# EasyEDA Pro project ProPrj_RC-Plate_2025-08-21.epro

# Schematic Schematic1
Board Name: Board1; Create Date: 2025-05-20; Page Name: P1; Project Name: RC-Plate; Schematic Name: Schematic1; Update Date: 2025-05-20; Company: EasyEDA.com; Page Size: A4; Version: V1.0
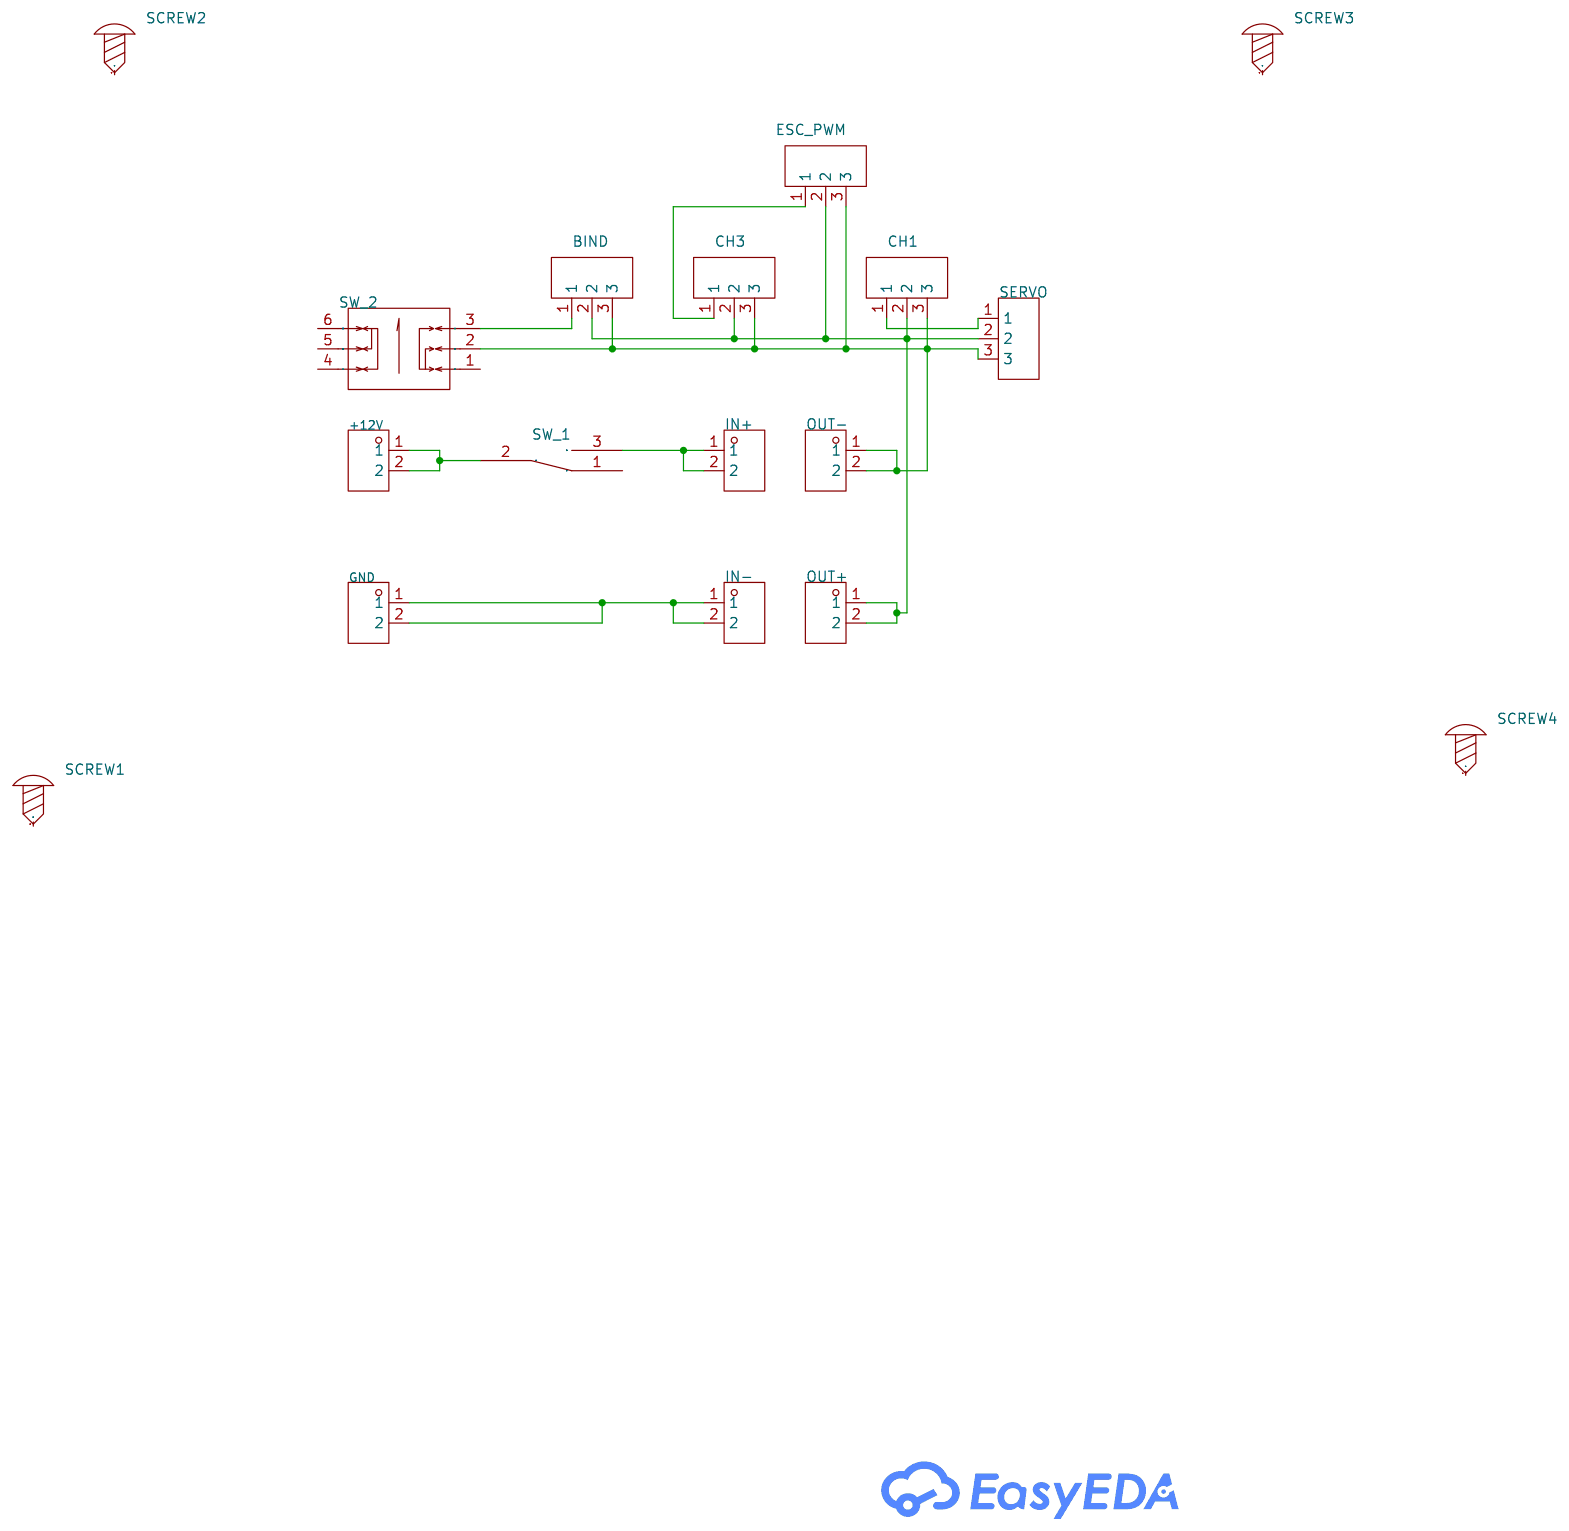
[diagram p0: schematic sheet]

## Parts
+12V  KF301-5.0-2P  [CONN-TH_P5.00_KF301-5.0-2P]
BIND  PM254V-11-03-H85  [HDR-TH_3P-P2.54-V-F]
CH1  PM254V-11-03-H85  [HDR-TH_3P-P2.54-V-F]
CH3  PM254V-11-03-H85  [HDR-TH_3P-P2.54-V-F]
ESC_PWM  PZ254V-11-03P  [HDR-TH_3P-P2.54-V-M]
GND  KF301-5.0-2P  [CONN-TH_P5.00_KF301-5.0-2P]
IN+  ZX-PM2.54-1-2PY  [HDR-TH_2P-P2.54-V-F]
IN-  ZX-PM2.54-1-2PY  [HDR-TH_2P-P2.54-V-F]
OUT+  ZX-PM2.54-1-2PY  [HDR-TH_2P-P2.54-V-F]
OUT-  ZX-PM2.54-1-2PY  [HDR-TH_2P-P2.54-V-F]
SCREW1  -  [Screw-Hole-M2]
SCREW2  -  [Screw-Hole-M2]
SCREW3  -  [Screw-Hole-M2]
SCREW4  -  [Screw-Hole-M2]
SERVO  PZ254V-11-03P  [HDR-TH_3P-P2.54-V-M]
SW_1  ST-0-102-A01-T000-LF  [SW-TH_3P-L8.3-W5.2-P2.54_ST-0-102-A01-T000]
SW_2  8-8 ZS  [SW-TH_6P-L8.0-W8.0-P2.50-TL]

## Library data of the parts
+12V GND = KF301-5.0-2P: Structure:1x2P Pitch:5mm Color:Blue Mounting Style:Straight Current Rating (Max):17A Voltage Rating (Max):250V Number of Pins:2P Number of Rows:1 Wire Gauge - AWG:14~22 Wire Gauge - AWG:14~22 Wire Gauge - mm2:1.5 Wire Gauge - mm2:1.5 Number of PINs Per Ro; LCSC Part Name: 5mm 1x2P 排数:1 每排P数:2 直插; Supplier Part: C474881; Manufacturer: KEFA(科发); Supplier Footprint: 插件,P=5mm; JLCPCB Part Class: Extended Part; Datasheet: https://atta.szlcsc.com/upload/public/pdf/source/20230317/03A5B5FC229D6F9225E8F51DA1A4E80A.pdf; Supplier: LCSC; Structure: 1x2P; Pitch: 5mm; Color: Blue; Mounting Style: Straight; Current Rating (Max): 17A; Voltage Rating (Max): 250V; Number of Pins: 2P; Number of Rows: 1; Wire Gauge - AWG: 14~22; Wire Gauge - mm2: 1.5; Number of PINs Per Row: 2; Operating Temperature Range: -30℃~+120℃
BIND CH1 CH3 = PM254V-11-03-H85: Holes Structure:1x3P Pitch:2.54mm Row Spacing:- Mounting Type:Straight Number of Rows:Plugin Number of Holes:3P Insulation Height:- Contact Material:Brass Contact Plating:-; LCSC Part Name: 间距:2.54mm 1x3P 直插; Supplier Part: C541850; Manufacturer: XFCN(兴飞); Supplier Footprint: 插件,P=2.54mm; JLCPCB Part Class: Extended Part; Datasheet: https://atta.szlcsc.com/upload/public/pdf/source/20200518/C541849_85853D71FC67C51915A806977A588FDA.pdf; Supplier: LCSC; Holes Structure: 1x3P; Pitch: 2.54mm; Mounting Type: Straight; Number of Rows: Plugin; Number of Holes: 3P; Contact Material: Brass
ESC_PWM SERVO = PZ254V-11-03P: Pin Structure:1x3P Pitch:2.54mm Row Spacing:- Circluar Pins/Square Pins:Policy Mounting Type:Straight Number of Rows:Single Row Number of Pins:3P Current Rating:3A Voltage Rating (Max):250V Length of Mating Pin:6mm Insulation Height:2.5mm Length of End Co; LCSC Part Name: 1x3P 间距:2.54mm 方针 直插; Supplier Part: C2937625; Manufacturer: XFCN(兴飞); Supplier Footprint: 插件,P=2.54mm; JLCPCB Part Class: Extended Part; Datasheet: https://atta.szlcsc.com/upload/public/pdf/source/20200309/C492402_8335C3D49C4E4C618838D59BB1D024C1.pdf; Supplier: LCSC; Pin Structure: 1x3P; Pitch: 2.54mm; Circluar Pins/Square Pins: Policy; Mounting Type: Straight; Number of Rows: Single Row; Number of Pins: 3P; Current Rating: 3A; Voltage Rating (Max): 250V; Length of Mating Pin: 6mm; Insulation Height: 2.5mm; Length of End Connection Pin: 3mm; Operating Temperature: -40℃~+105℃; Color: Black
IN+ IN- OUT+ OUT- = ZX-PM2.54-1-2PY: Holes Structure:1x2P Pitch:2.54mm Row Spacing:- Circular Hole / Square Hole:Square Hole Mounting Type:Direct Insert Number of Rows:Single Row Number of Holes:2P Current Rating (Max):- Voltage Rating (Max):1kV Holes Direction:Top Insulation Height:8.5mm Co; LCSC Part Name: 1x2P 间距:2.54mm 直插; Supplier Part: C7499322; Manufacturer: Megastar(兆星); Supplier Footprint: 插件,P=2.54mm; JLCPCB Part Class: Extended Part; Datasheet: https://atta.szlcsc.com/upload/public/pdf/source/20231122/F22175ABE3DCBFEB9E36A2E7DA44623C.pdf; Supplier: LCSC; Holes Structure: 1x2P; Pitch: 2.54mm; Circular Hole / Square Hole: Square Hole; Mounting Type: Direct Insert; Number of Rows: Single Row; Number of Holes: 2P; Voltage Rating (Max): 1kV; Holes Direction: Top; Insulation Height: 8.5mm; Contact Plating: Gold; Operating Temperature Range: -40℃~+105℃; Soldering Temperature(Max): 260℃@5S
SCREW1-SCREW4 = Screw-Hole-M2: Supplier Footprint: 插件
SW_1 = ST-0-102-A01-T000-LF: Circuit:Single Pole Double Throw (SPDT) Switch Length:8.3mm Switch Width:5.2mm Switch Height:23.6mm Mechanical Life:- Contact Current:3A Voltage Rating (AC):125V Actuator Type:Cylinder knob Pin Style:Solder Mounting Style:Direct Insert Operating Temperatu; LCSC Part Name: 超小型钮子三脚二档 五件套 含配件; Supplier Part: C1788487; Manufacturer: YUEN FUNG(源丰); Supplier Footprint: 插件; JLCPCB Part Class: Extended Part; Datasheet: https://atta.szlcsc.com/upload/public/pdf/source/20230720/31DDFEC61AC21D005BE18E754C3E93F0.pdf; Supplier: LCSC; Circuit: Single Pole Double Throw (SPDT); Switch Length: 8.3mm; Switch Width: 5.2mm; Switch Height: 23.6mm; Contact Current: 3A; Voltage Rating (AC): 125V; Actuator Type: Cylinder knob; Pin Style: Solder; Mounting Style: Direct Insert; Operating Temperature: -25℃~+85℃
SW_2 = 8-8 ZS: Circuit:DPDT Self Lock / No Lock:LATCHING Actuator Style:Rectangular Plunger IP Rating:- Mounting Style:Straight Contact Current:100mA Voltage Rating (AC):- Voltage Rating (DC):30V Insulation Resistance:100MΩ Actuator/Cap Color:Blue With Lamp:不带 Pin Style; LCSC Part Name: 按键开关8x8 自锁高头 180gf; Supplier Part: C5379893; Manufacturer: SHOU HAN(首韩); Supplier Footprint: 插件; JLCPCB Part Class: Extended Part; Datasheet: https://atta.szlcsc.com/upload/public/pdf/source/20230920/344D9C55231D4D6DD37BED301252459B.pdf; Supplier: LCSC; Circuit: DPDT; Self Lock / No Lock: LATCHING; Actuator Style: Rectangular Plunger; Mounting Style: Straight; Contact Current: 100mA; Voltage Rating (DC): 30V; Insulation Resistance: 100MΩ; Actuator/Cap Color: Blue; With Lamp: 不带; Pin Style: PCPin; Operating Force: 180gf; Operating Temperature: -10℃~+70℃; Mechanical Life: 5千次

## Nets
$1N1038: BIND.2 CH1.2 CH3.2 ESC_PWM.2 OUT+.1 OUT+.2 SERVO.2
$1N1638: CH1.1 SERVO.1
$1N1730: CH3.1 ESC_PWM.1
$1N1971: +12V.1 +12V.2 SW_1.2
$1N1976: GND.1 GND.2 IN-.1 IN-.2
$1N2611: IN+.1 IN+.2 SW_1.3
Net-(BIND-1): BIND.1 SW_2.3
Net-(BIND-3): BIND.3 CH1.3 CH3.3 ESC_PWM.3 OUT-.1 OUT-.2 SERVO.3 SW_2.2

Not connected (* = marked no-connect by the designer): SCREW1 1; SCREW2 1; SCREW3 1; SCREW4 1; SW_1 1; SW_2 1 4 5 6

# Board RC-Plate1
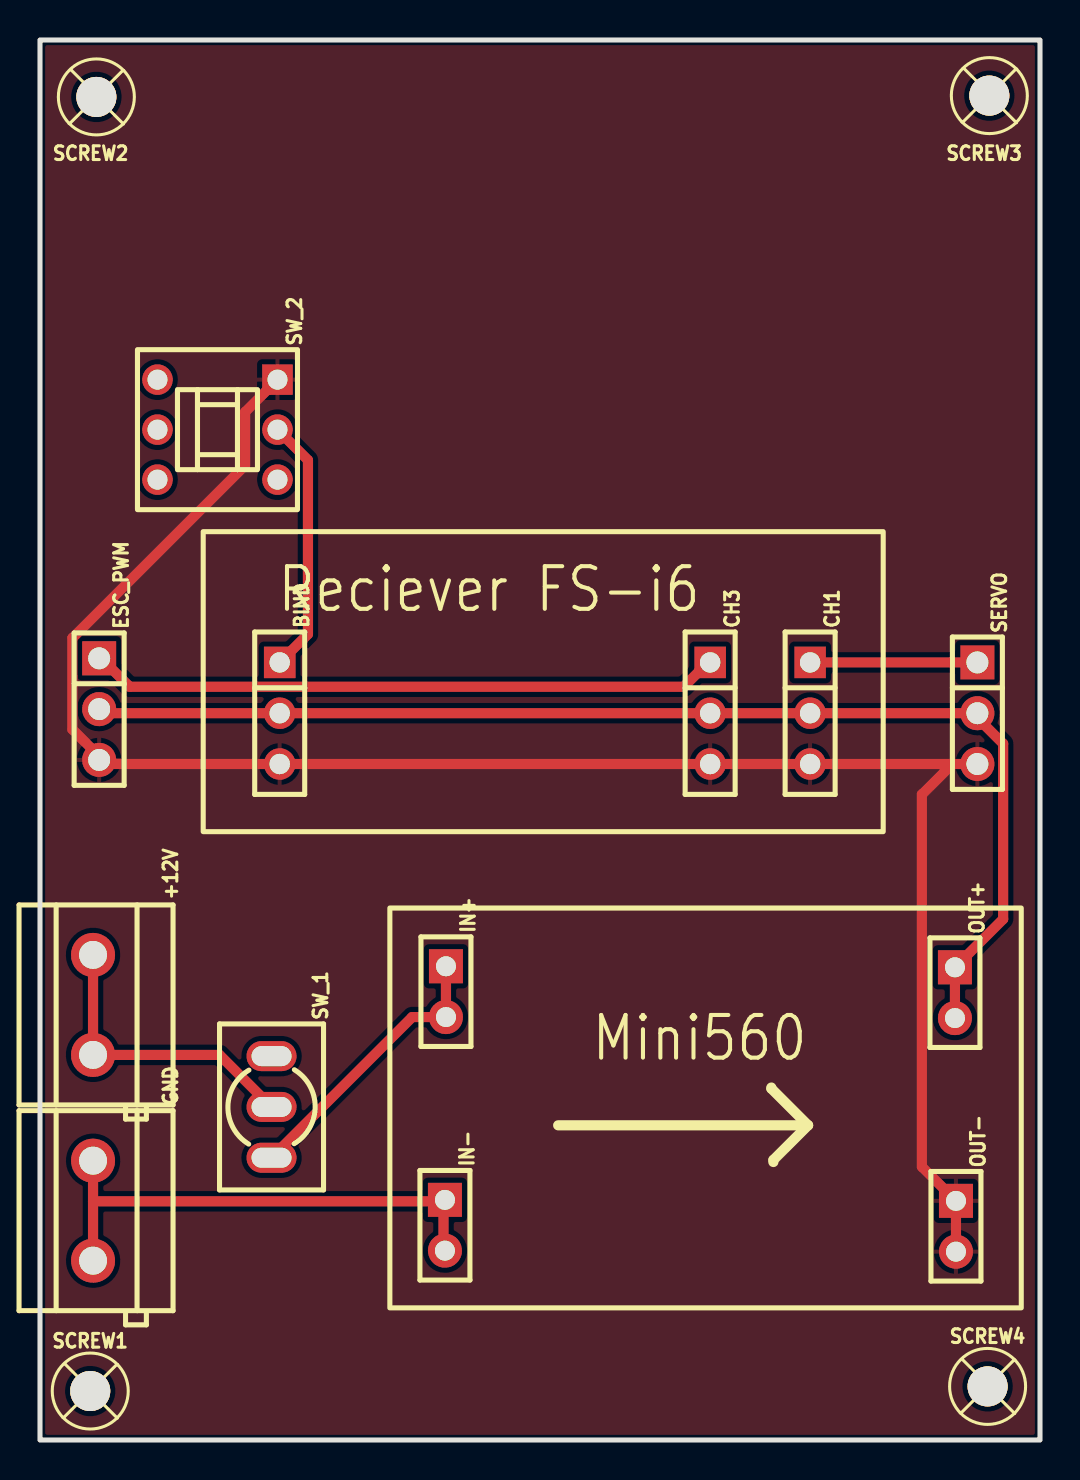
[diagram p1: board, top side]
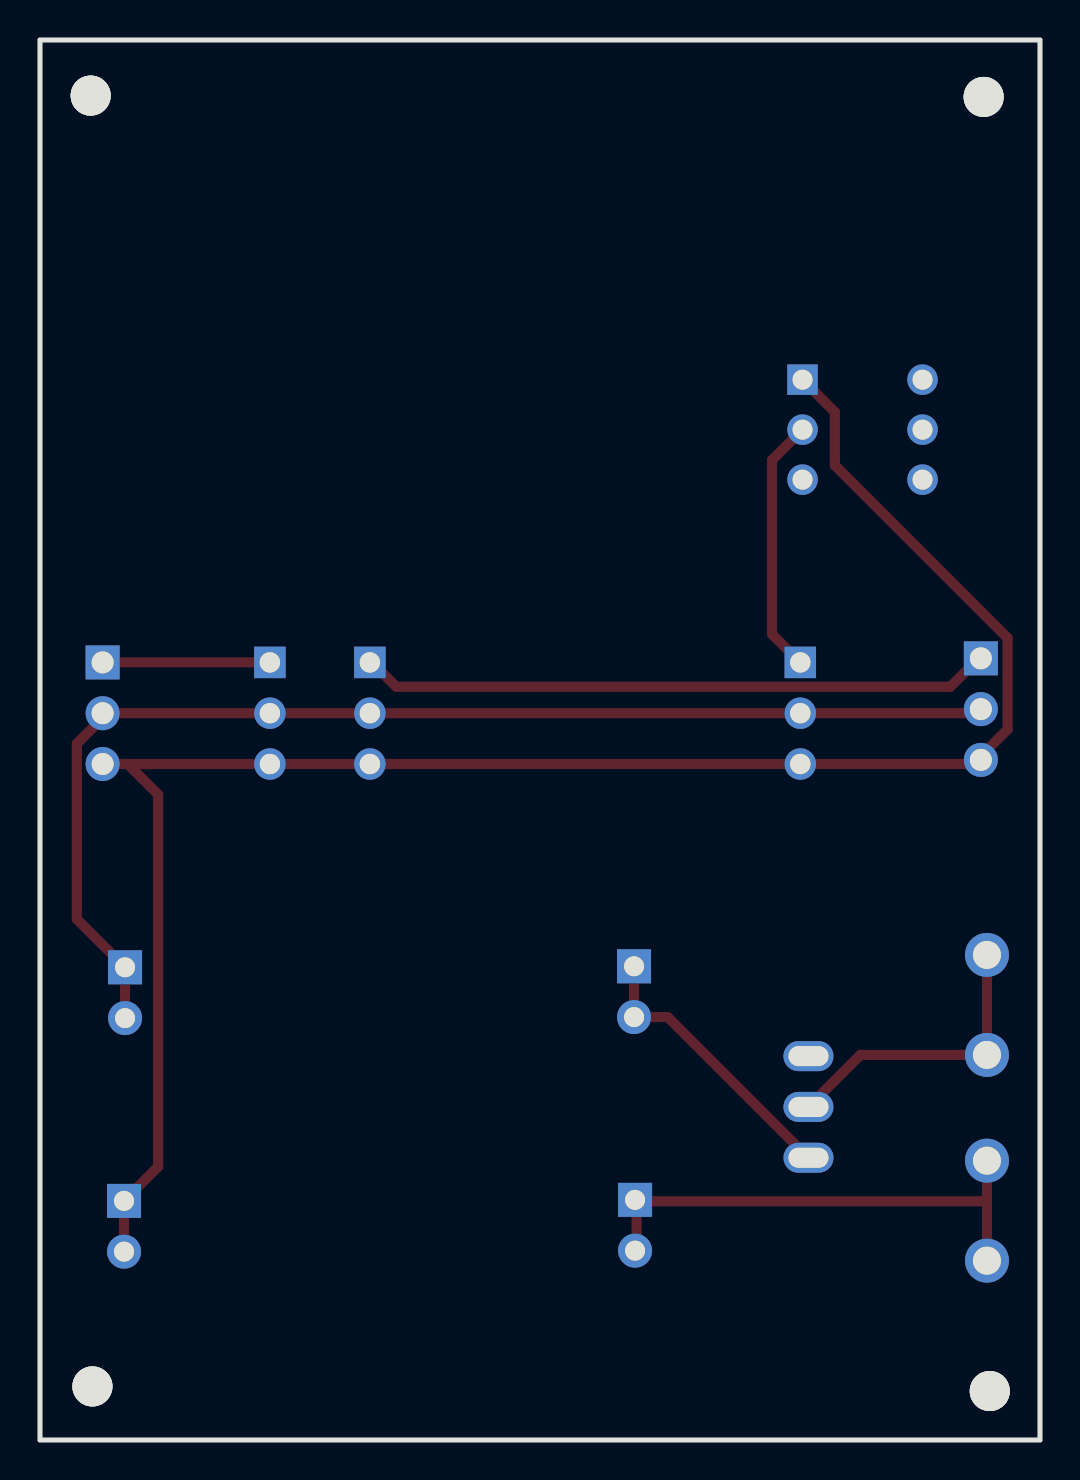
[diagram p2: board, bottom side, seen from below]

Outline 50 x 70 mm; copper layers: Top Layer, Bottom Layer. Coordinates in mm from the lower left corner of the outline.
Outline path: rectangle 0,70 50,0
Stack: Top Layer 0.035mm / Dielectric1 1.51mm FR4 er 4.5 / Bottom Layer 0.035mm

## Design rules (mm)
template: Custom Config
spacing copperThickness1oz (default): track to track 0.102, other pairs 0.152 to 0.3
spacing copperThickness2oz: track to track 0.203, other pairs 0.152 to 0.3
track width copperThickness1oz: min 0.127, default 0.254, max 2.54
track width copperThickness2oz: min 0.203, default 0.254, max 2.54
track width thrack3oz (default): min 0.254, default 0.508, max 2.54
differential pair differentialPair (default): width min 0.127, default 0.254, max 2.54; gap min 0.152, default 0.152
via viaSize (default): diameter min 0.5, default 0.61, max 10; hole min 0.3, default 0.305, max 6.3

## Placement (name value [footprint] x y rotation side)
+12V  KF301-5.0-2P  [CONN-TH_P5.00_KF301-5.0-2P]  2.65 21.75 270 top
BIND  PM254V-11-03-H85  [HDR-TH_3P-P2.54-V-F]  11.98 36.34 270 top
CH1  PM254V-11-03-H85  [HDR-TH_3P-P2.54-V-F]  38.51 36.34 270 top
CH3  PM254V-11-03-H85  [HDR-TH_3P-P2.54-V-F]  33.51 36.34 270 top
ESC_PWM  PZ254V-11-03P  [HDR-TH_3P-P2.54-V-M]  2.96 36.54 270 top
GND  KF301-5.0-2P  [CONN-TH_P5.00_KF301-5.0-2P]  2.65 11.47 270 top
IN+  ZX-PM2.54-1-2PY  [HDR-TH_2P-P2.54-V-F]  20.3 22.42 270 top
IN-  ZX-PM2.54-1-2PY  [HDR-TH_2P-P2.54-V-F]  20.25 10.74 270 top
OUT+  ZX-PM2.54-1-2PY  [HDR-TH_2P-P2.54-V-F]  45.75 22.37 270 top
OUT-  ZX-PM2.54-1-2PY  [HDR-TH_2P-P2.54-V-F]  45.8 10.69 270 top
SCREW1  -  [Screw-Hole-M2]  2.51 2.45 0 top
SCREW2  -  [Screw-Hole-M2]  2.82 67.15 0 top
SCREW3  -  [Screw-Hole-M2]  47.47 67.22 0 top
SCREW4  -  [Screw-Hole-M2]  47.38 2.68 0 top
SERVO  PZ254V-11-03P  [HDR-TH_3P-P2.54-V-M]  46.87 36.34 270 top
SW_1  ST-0-102-A01-T000-LF  [SW-TH_3P-L8.3-W5.2-P2.54_ST-0-102-A01-T000]  11.58 16.65 270 top
SW_2  8-8 ZS  [SW-TH_6P-L8.0-W8.0-P2.50-TL]  8.87 50.52 270 top

## Footprints (pads in the part's own frame, mm; a bottom-side part is the same pattern mirrored in y, then rotated)
CONN-TH_P5.00_KF301-5.0-2P
  round 2.2 hole 1.4: 1(-2.5,0) 2(2.5,0)
HDR-TH_2P-P2.54-V-F
  rect 1.7x1.7 hole 1: 1(-1.27,0)
  round 1.7 hole 1: 2(1.27,0)
HDR-TH_3P-P2.54-V-F
  rect 1.575x1.575 hole 1.02: 1(-2.54,0)
  round 1.575 hole 1.02: 2(0,0) 3(2.54,0)
HDR-TH_3P-P2.54-V-M
  rect 1.7x1.7 hole 1.1: 1(-2.54,0)
  round 1.7 hole 1.1: 2(0,0) 3(2.54,0)
Screw-Hole-M2
  round 2 hole 2: 1(0,0)
SW-TH_3P-L8.3-W5.2-P2.54_ST-0-102-A01-T000
  oval 1.5x2.5 hole 1x2: 1(-2.54,0) 2(0,0) 3(2.54,0)
SW-TH_6P-L8.0-W8.0-P2.50-TL
  rect 1.524x1.524 hole 1: 1(-2.5,3)
  round 1.524 hole 1: 2(0,3) 3(2.5,3) 4(-2.5,-3) 5(0,-3) 6(2.5,-3)

## Nets
$1N1038: BIND.2 CH1.2 CH3.2 ESC_PWM.2 OUT+.1 OUT+.2 SERVO.2
$1N1056: BIND.3 CH1.3 CH3.3 ESC_PWM.3 OUT-.1 OUT-.2 SERVO.3 SW_2.1
$1N1638: CH1.1 SERVO.1
$1N1730: CH3.1 ESC_PWM.1
$1N1874: BIND.1 SW_2.2
$1N1971: +12V.1 +12V.2 SW_1.2
$1N1976: GND.1 GND.2 IN-.1 IN-.2
$1N2611: IN+.1 IN+.2 SW_1.3

Pads without a net: SCREW1 1; SCREW2 1; SCREW3 1; SCREW4 1; SW_1 1; SW_2 3 4 5 6

## Routing (per net, layer and track width the routed paths; a pad name or vN(x,y) marks a point on that pad's centre or on a via; arc(x,y) is an arc through that point)
$1N1038: length 60.9
  Top Layer w0.508: ESC_PWM.2 3.16,36.34 BIND.2 CH3.2 CH1.2 46.63,36.34 ; 46.63,36.34 48.16,34.82 48.16,26.05 OUT+.1 OUT+.2 ; 46.63,36.34 SERVO.2
$1N1056: length 93.6
  Top Layer w0.508: 45.62,33.8 44.09,32.28 44.09,13.66 OUT-.1 OUT-.2 ; 45.62,33.8 SERVO.3 ; 45.62,33.8 CH1.3 CH3.3 BIND.3 3.35,33.8 3.14,34 ; 3.14,34 1.62,35.53 1.62,40.1 10.26,48.74 10.26,51.4 SW_2.1 ; 3.14,34 ESC_PWM.3
$1N1638: length 8.4
  Top Layer w0.508: CH1.1 SERVO.1
$1N1730: length 31.6
  Top Layer w0.508: CH3.1 33.4,38.88 32.19,37.66 4.48,37.66 3.06,39.08 ESC_PWM.1
$1N1874: length 12.9
  Top Layer w0.508: BIND.1 13.4,40.29 13.4,48.99 SW_2.2
$1N1971: length 15
  Top Layer w0.508: SW_1.2 8.98,19.25 +12V.2 +12V.1
$1N1976: length 25.1
  Top Layer w0.508: 2.65,11.93 20.17,11.93 ; 2.65,11.93 GND.1 ; 2.65,11.93 GND.2 ; 20.17,11.93 20.17,9.54 IN-.2 ; 20.17,11.93 IN-.1
$1N2611: length 14.2
  Top Layer w0.508: SW_1.3 18.61,21.15 IN+.2 IN+.1

## Copper pours and planes (outline as drawn; the poured copper is in the pictures)
$1N1056 on Top Layer: 0,70 50,70 50,0 0,0

## Text on the board
Top Silkscreen Layer: Reciever FS-i6 | Mini560
